# Altium schematic sheet kd_inz_supply.SchDoc
size A3; SheetNumber: 3; SheetTotal: 3; SPICEModelCacheAOTSFBYF: <root> / <DocumentId>AOTSFBYF</DocumentId> / <CacheFrame Number="0"> / <Model Name="cap" Kind="MDL"> / <Text>*Default semiconductor capacitor / .MODEL CAP C()</Text> / </Model> / </CacheFrame> / </root>
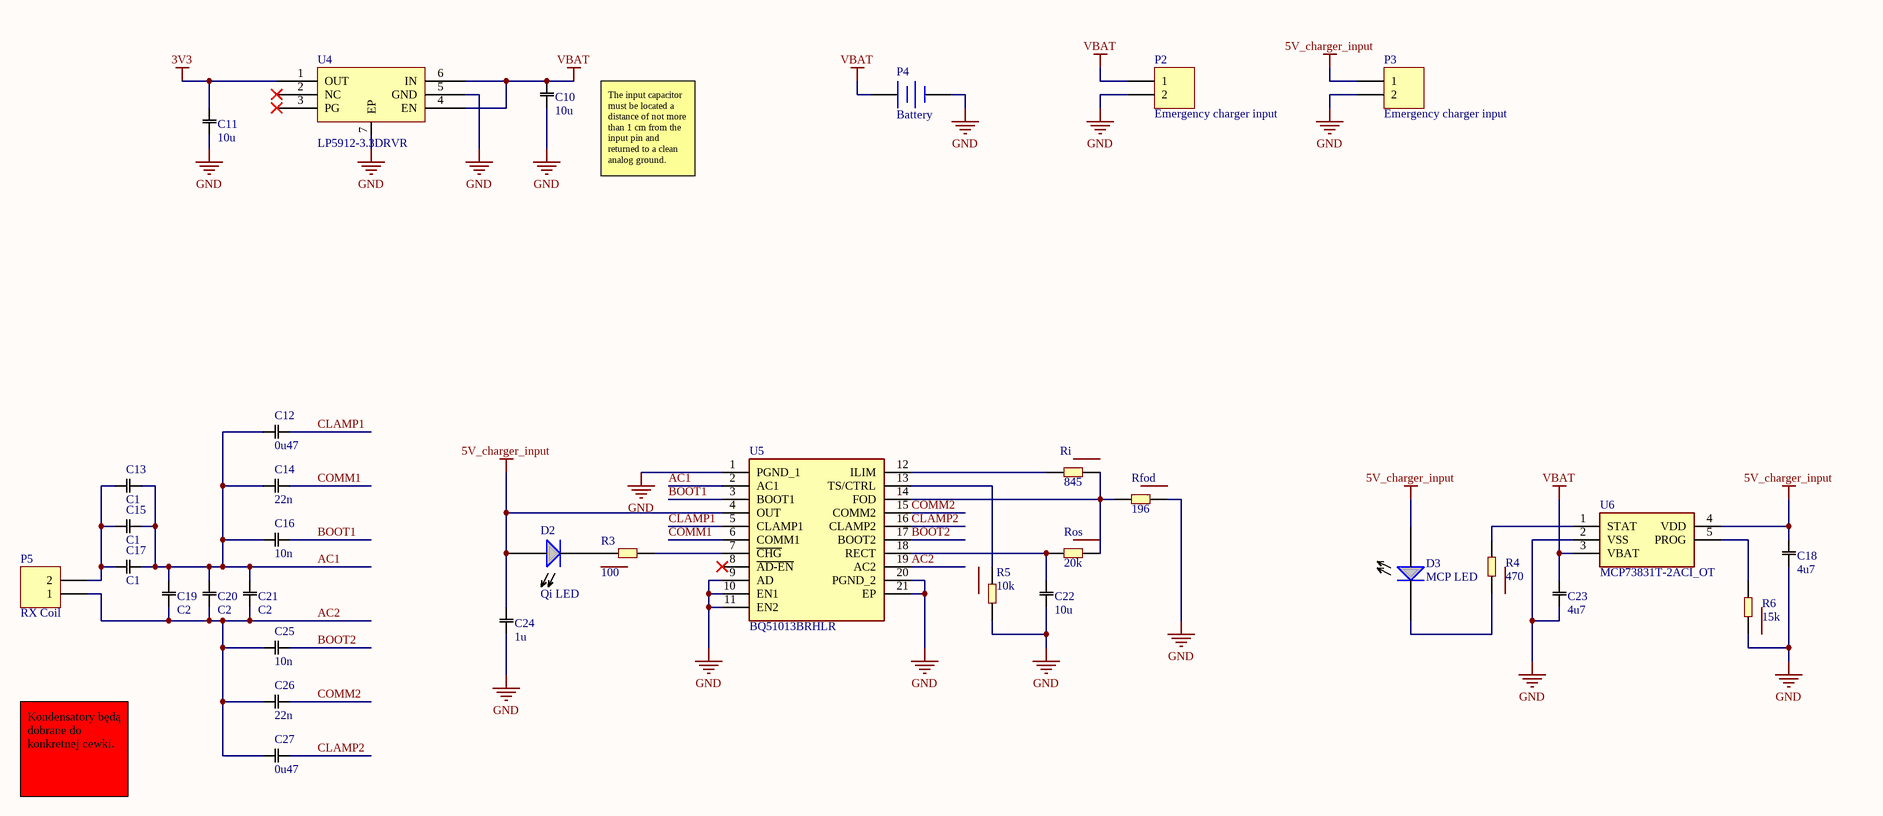
[diagram p0: kd_inz_supply.SchDoc]

## Parts
C10  10u  [0402]
C11  10u  [0402]
C12  0u47  [0402]
C13  C1  [0402]
C14  22n  [0402]
C15  C1  [0402]
C16  10n  [0402]
C17  C1  [0402]
C18  4u7  [0402]
C19  C2  [0402]
C20  C2  [0402]
C21  C2  [0402]
C22  10u  [0402]
C23  4u7  [0402]
C24  1u  [0402]
C25  10n  [0402]
C26  22n  [0402]
C27  0u47  [0402]
D2  Qi LED  [0402]
D3  MCP LED  [0402]
P2  Emergency charger input  [HDR1X2]
P3  Emergency charger input  [HDR1X2]
P4  Battery  [BAT-2]
P5  RX Coil  [HDR1X2]
R3  100  [0402]
R4  470  [0402]
R5  10k  [0402]
R6  15k  [0402]
Rfod  196  [0402]
Ri  845  [0402]
Ros  20k  [0402]
U4  LP5912-3.3DRVR  [WSON-6]
U5  BQ51013BRHLR  [BQ51050BRHLR]
U6  MCP73831T-2ACI_OT  [SOT95P270X145-5N]

## Nets
3V3: C11.2 U4.1(OUT)
5V_charger_input: C18.2 C24.2 D2.2 D3.2 P3.1 U5.4(OUT) U6.4(VDD)
GND: C10.1 C11.1 C18.1 C22.1 C23.1 C24.1 P2.2 P3.2 P4.2(-) R5.1 R6.2 Rfod.2 U4.5(GND) U4.7(EP) U5.1(PGND_1) U5.9(AD) U5.10(EN1) U5.11(EN2) U5.20(PGND_2) U5.21(EP) U6.2(VSS)
VBAT: C10.2 C23.2 P2.1 P4.1(+) U4.4(EN) U4.6(IN) U6.3(VBAT)
AC1: C12.2 C13.2 C14.1 C15.2 C16.1 C17.2 C19.2 C20.2 C21.2 U5.2(AC1)
AC2: C19.1 C20.1 C21.1 C25.1 C26.1 C27.1 P5.1 U5.19(AC2)
BOOT1: C16.2 U5.3(BOOT1)
BOOT2: C25.2 U5.17(BOOT2)
CLAMP1: C12.1 U5.5(CLAMP1)
CLAMP2: C27.2 U5.16(CLAMP2)
COMM1: C14.2 U5.6(COMM1)
COMM2: C26.2 U5.15(COMM2)
NetC13_1: C13.1 C15.1 C17.1 P5.2
NetC22_2: C22.2 Ros.1 U5.18(RECT)
NetD2_1: D2.1 R3.2
NetD3_1: D3.1 R4.2
NetR3_1: R3.1 U5.7(~{CHG})
NetR4_1: R4.1 U6.1(STAT)
NetR5_2: R5.2 U5.13(TS/CTRL)
NetR6_1: R6.1 U6.5(PROG)
NetRfod_1: Rfod.1 Ri.2 Ros.2 U5.14(FOD)
NetRi_1: Ri.1 U5.12(ILIM)

Not connected (* = marked no-connect by the designer): U4 2(NC)* 3(PG)*; U5 8(~{AD-EN})*

## Notes on the sheet
- The input capacitor must be located a distance of not more than 1 cm from the input pin and returned to a clean
  analog ground.
- Kondensatory będą dobrane do konkretnej cewki.

## Library data of the parts
C10-C27 = C: Capacitor
D2 D3 = LED
P2 P3 P5 = Header 2: Header, 2-Pin; LatestRevisionDate: 17-Jul-2002; LatestRevisionNote: Re-released for DXP Platform.; Publisher: Altium Limited
P4 = Battery: Multicell Battery; Published: 24-Mar-1999; LatestRevisionDate: 17-Jul-2002; LatestRevisionNote: Re-released for DXP Platform.; PackageReference: BAT-2; Publisher: Altium Limited; PackageDescription: Battery; 2 Leads
R3-R6 Rfod Ri Ros = R: Resistor
U4 = LP5912
U5 = BQ51013BRHLR: Integrated Circuit; Manufacturer_Name: Texas Instruments; Datasheet Link: http://www.ti.com/lit/ds/symlink/bq51013b.pdf; Manufacturer_Part_Number: BQ51013BRHLR; Mouser Part Number: 595-BQ51013BRHLR; Mouser Price/Stock: https://www.mouser.co.uk/ProductDetail/Texas-Instruments/BQ51013BRHLR?qs=y1vSg4rOnUJlN8ZPg6D5Pw%3D%3D; Arrow Part Number: BQ51013BRHLR; Arrow Price/Stock: https://www.arrow.com/en/products/bq51013brhlr/texas-instruments?region=nac
U6 = MCP73831T-2ACI_OT: Integrated Circuit; Manufacturer_Name: Microchip; Manufacturer_Part_Number: MCP73831T-2ACI/OT; Datasheet Link: http://ww1.microchip.com/downloads/en/DeviceDoc/20001984g.pdf; Height: 1.45mm; Mouser Part Number: 579-MCP73831T-2ACIOT; Mouser Price/Stock: https://www.mouser.co.uk/ProductDetail/Microchip-Technology/MCP73831T-2ACI-OT?qs=yUQqVecv4qvbBQBGbHx0Mw%3D%3D; Arrow Part Number: MCP73831T-2ACI/OT; Arrow Price/Stock: https://www.arrow.com/en/products/mcp73831t-2aciot/microchip-technology?region=nac